# EAGLE design neato_lcd_adapter (EAGLE 8.3.2)
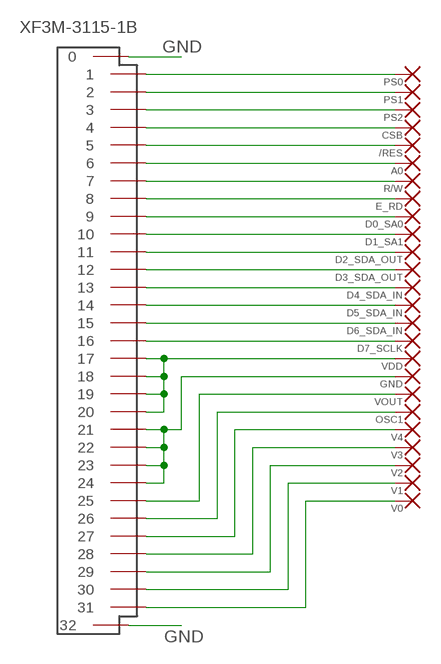
[diagram p0: schematic, sheet 1]

## Parts
/RES  SMD2  [SMD_PAD]
A0  SMD2  [SMD_PAD]
CSB  SMD2  [SMD_PAD]
D0_SA0  SMD2  [SMD_PAD]
D1_SA1  SMD2  [SMD_PAD]
D2_SDA_OUT  SMD2  [SMD_PAD]
D3_SDA_OUT  SMD2  [SMD_PAD]
D4_SDA_IN  SMD2  [SMD_PAD]
D5_SDA_IN  SMD2  [SMD_PAD]
D6_SDA_IN  SMD2  [SMD_PAD]
D7_SCLK  SMD2  [SMD_PAD]
E_RD  SMD2  [SMD_PAD]
GND  SMD2  [SMD_PAD]
LCD  XF3M-3115-1B  [FPC-31P-0.5MM]
OSC1  SMD2  [SMD_PAD]
PS0  SMD2  [SMD_PAD]
PS1  SMD2  [SMD_PAD]
PS2  SMD2  [SMD_PAD]
R/W  SMD2  [SMD_PAD]
V0  SMD2  [SMD_PAD]
V1  SMD2  [SMD_PAD]
V2  SMD2  [SMD_PAD]
V3  SMD2  [SMD_PAD]
V4  SMD2  [SMD_PAD]
VDD  SMD2  [SMD_PAD]
VOUT  SMD2  [SMD_PAD]

## Nets
GND: LCD.P$1 LCD.P$2
N$1: LCD.P$3 PS0.1(P)
N$2: LCD.P$4 PS1.1(P)
N$3: LCD.P$5 PS2.1(P)
N$4: CSB.1(P) LCD.P$6
N$5: /RES.1(P) LCD.P$7
N$6: A0.1(P) LCD.P$8
N$7: LCD.P$9 R/W.1(P)
N$8: E_RD.1(P) LCD.P$10
N$9: D0_SA0.1(P) LCD.P$11
N$10: D1_SA1.1(P) LCD.P$12
N$11: D2_SDA_OUT.1(P) LCD.P$13
N$12: D3_SDA_OUT.1(P) LCD.P$14
N$13: D4_SDA_IN.1(P) LCD.P$15
N$14: D5_SDA_IN.1(P) LCD.P$16
N$15: D6_SDA_IN.1(P) LCD.P$17
N$16: D7_SCLK.1(P) LCD.P$18
N$17: LCD.P$19 LCD.P$20 LCD.P$21 LCD.P$22 VDD.1(P)
N$18: GND.1(P) LCD.P$23 LCD.P$24 LCD.P$25 LCD.P$26
N$19: LCD.P$27 VOUT.1(P)
N$20: LCD.P$28 OSC1.1(P)
N$21: LCD.P$29 V4.1(P)
N$22: LCD.P$30 V3.1(P)
N$23: LCD.P$31 V2.1(P)
N$24: LCD.P$32 V1.1(P)
N$25: LCD.P$33 V0.1(P)

## Library data of the parts
/RES A0 CSB D0_SA0 D1_SA1 D2_SDA_OUT D3_SDA_OUT D4_SDA_IN D5_SDA_IN D6_SDA_IN D7_SCLK E_RD GND OSC1 PS0 PS1 PS2 R/W V0 V1-V4 VDD VOUT = neato_lcd_adapter:SMD2: SMD PAD
LCD = neato_lcd_adapter:XF3M-3115-1B

## Board
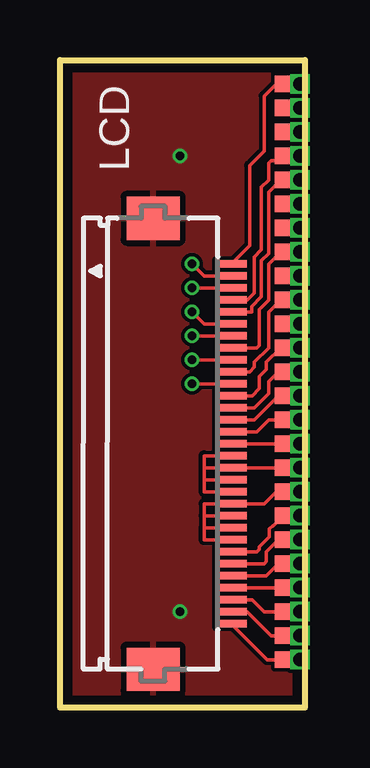
[diagram p1: board, top side]
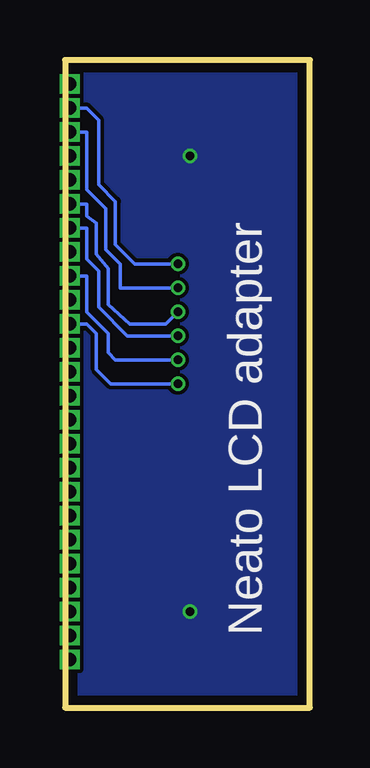
[diagram p2: board, bottom side, seen from below]

Size 10.2 x 27 mm. Coordinates in mm from the lower left corner, seen from the top.
Outline: 10.2,27 10.2,0 0,0 0,27 10.2,27
Copper layers (1*16): Top 0.035559375mm / dielectric 1.6mm / Bottom 0.035559375mm
Design rules "oshpark-2layer": minimum track width 6mil, minimum drill 10mil, track to track 6mil, track to pad 6mil, pad to pad 6mil, via to via 6mil, smd to smd 6mil, copper to edge 15mil, drill to drill 6mil, minimum pad ring 5mil, minimum via ring 5mil, stop-mask expansion 2.5mil, vias tented up to drill 0mil, thermal gap 10mil

### Footprints (pad centres in the part's own frame; a part is rotated, then mirrored left to right if it is on the bottom)
SMD_PAD = smd 0.7 x 0.7: 1 0,0
FPC-31P-0.5MM = smd 1.8 x 2.2: P$1 9.41,-1.1; P$2 -9.39,-1.1 | smd 0.3 x 1.3: P$3 -7.49,2.15; P$4 -6.99,2.15; P$5 -6.49,2.15; P$6 -5.99,2.15; P$7 -5.49,2.15; P$8 -4.99,2.15; P$9 -4.49,2.15; P$10 -3.99,2.15; P$11 -3.49,2.15; P$12 -2.99,2.15; P$13 -2.49,2.15; P$14 -1.99,2.15; P$15 -1.49,2.15; P$16 -0.99,2.15; P$17 -0.49,2.15; P$18 0.01,2.15; P$19 0.51,2.15; P$20 1.01,2.15; P$21 1.51,2.15; P$22 2.01,2.15; P$23 2.51,2.15; P$24 3.01,2.15; P$25 3.51,2.15; P$26 4.01,2.15; P$27 4.51,2.15; P$28 5.01,2.15; P$29 5.51,2.15; P$30 6.01,2.15; P$31 6.51,2.15; P$32 7.01,2.15; P$33 7.51,2.15

### Placement (x,y rotation side)
/RES  9.3,22 0 top
A0  9.3,21 0 top
CSB  9.3,23 0 top
D0_SA0  9.3,18 0 top
D1_SA1  9.3,17 0 top
D2_SDA_OUT  9.3,16 0 top
D3_SDA_OUT  9.3,15 0 top
D4_SDA_IN  9.3,14 0 top
D5_SDA_IN  9.3,13 0 top
D6_SDA_IN  9.3,12 0 top
D7_SCLK  9.3,11 0 top
E_RD  9.3,19 0 top
GND  9.3,9 0 top
LCD  4.98,11.01 270 top
OSC1  9.3,7 0 top
PS0  9.3,26 0 top
PS1  9.3,25 0 top
PS2  9.3,24 0 top
R/W  9.3,20 0 top
V0  9.3,2 0 top
V1  9.3,3 0 top
V2  9.3,4 0 top
V3  9.3,5 0 top
V4  9.3,6 0 top
VDD  9.3,10 0 top
VOUT  9.3,8 0 top

### Tracks (layer width: path | path; a pad name or v marks a point on that pad's centre or on a via)
GND  (via drill 0.35)
  other vias: 5,23 5,4
  pour Bottom: 10,27 0,27 0,0 10,0
  pour Top: 0,27 0,0 10,0 10,27
N$1  (via drill 0.55)
  Top 0.152: v10,26 PS0.1 9,26 8.5,25.5 8.5,23.2 7.9,22.6 7.9,19.27 LCD.P$3
N$2  (via drill 0.35, 0.55)
  Top 0.152: v10,25 PS1.1 | LCD.P$4 6,18 v5.5,18.5
  Bottom 0.152: v5.5,18.5 7.3,18.5 8.1,19.3 8.1,21.1 8.8,21.8 8.8,24.5 PS1.1 v10,25
N$3  (via drill 0.35, 0.55)
  Top 0.152: v10,24 PS2.1 | LCD.P$5 v5.5,17.5
  Bottom 0.152: v5.5,17.5 7.9,17.5 7.9,18.5 8.5,19.1 8.5,20.8 9.3,21.6 PS2.1 v10,24
N$4  (via drill 0.55)
  Top 0.152: LCD.P$6 7.8,17 8.09,17.29 8.09,18.79 8.4,19.09 8.4,21.69 8.7,22 8.7,22.7 8.8,22.8 9.1,22.8 CSB.1 v10,23
N$5  (via drill 0.55)
  Top 0.152: v10,22 /RES.1 9.2,22 8.7,21.5 8.7,18.93 8.4,18.63 8.4,17.13 7.99,16.73 7.99,16.5 LCD.P$7
N$6  (via drill 0.35, 0.55)
  Top 0.152: v10,21 A0.1 | LCD.P$8 6,16 v5.5,16.5
  Bottom 0.152: v5.5,16.5 6,16 7.5,16 8.4,16.8 8.4,18.3 8.9,18.9 8.9,20.2 9.3,20.5 A0.1 v10,21
N$7  (via drill 0.35, 0.55)
  Top 0.152: LCD.P$9 v5.5,15.5 | v10,20 R/W.1
  Bottom 0.152: v5.5,15.5 7.6,15.5 8.8,16.7 8.8,18.2 9.3,18.7 R/W.1 v10,20
N$8  (via drill 0.55)
  Top 0.152: v10,19 E_RD.1 9.2,19 8.7,18.5 8.7,17 8.3,16.6 8.3,15.1 8.2,15 LCD.P$10
N$9  (via drill 0.35, 0.55)
  Top 0.152: LCD.P$11 v5.5,14.5 | v10,18 D0_SA0.1
  Bottom 0.152: v5.5,14.5 8.1,14.5 8.4,14.8 8.4,15.6 9.3,16.5 D0_SA0.1 v10,18
N$10  (via drill 0.55)
  Top 0.152: LCD.P$12 7.9,14 8.1,14.2 8.1,14.4 8.7,15 8.7,16.5 9.2,17 D1_SA1.1 v10,17
N$11  (via drill 0.35, 0.55)
  Top 0.152: D2_SDA_OUT.1 v10,16 | LCD.P$13 v5.5,13.5
  Bottom 0.152: v5.5,13.5 8.3,13.5 8.9,14.1 8.9,15.6 D2_SDA_OUT.1 v10,16
N$12  (via drill 0.55)
  Top 0.152: LCD.P$14 8,13 8.3,13.3 8.3,13.8 8.6,14.1 8.6,14.4 9.2,15 D3_SDA_OUT.1 v10,15
N$13  (via drill 0.55)
  Top 0.152: v10,14 D4_SDA_IN.1 9.1,14 8.7,13.6 8.7,13.1 8.1,12.5 LCD.P$15
N$14  (via drill 0.55)
  Top 0.152: LCD.P$16 8.1,12 9.1,13 D5_SDA_IN.1 v10,13
N$15  (via drill 0.55)
  Top 0.152: LCD.P$17 8.2,11.5 8.7,12 D6_SDA_IN.1 v10,12
N$16  (via drill 0.55)
  Top 0.152: LCD.P$18 D7_SCLK.1 v10,11
N$17  (via drill 0.55)
  Top 0.152: LCD.P$22 6,9 6,9.5 | 6,9.5 LCD.P$21 | 6,9.5 6,10 | 6,10 LCD.P$20 VDD.1 v10,10 | 6,10 6,10.5 LCD.P$19
N$18  (via drill 0.55)
  Top 0.152: LCD.P$26 6,7 6,7.5 | LCD.P$25 6,7.5 | 6,8 6,7.5 | LCD.P$24 6,8 | 6,8 6,8.5 LCD.P$23 8.5,8.5 9,9 GND.1 v10,9
N$19  (via drill 0.55)
  Top 0.152: v10,8 VOUT.1 8.88,7.58 8.85,7.58 8.72,7.45 8.72,7.12 8.3,6.7 8.3,6.63 8.3,6.59 8.2,6.5 LCD.P$27
N$20  (via drill 0.55)
  Top 0.152: LCD.P$28 8.5,6 8.6,6.1 8.6,6.5 9.1,7 OSC1.1 v10,7
N$21  (via drill 0.55)
  Top 0.152: LCD.P$29 8.6,5.5 9.1,6 V4.1 v10,6
N$22  (via drill 0.55)
  Top 0.152: LCD.P$30 V3.1 v10,5
N$23  (via drill 0.55)
  Top 0.152: v10,4 V2.1 8.5,4 8,4.5 LCD.P$31
N$24  (via drill 0.55)
  Top 0.152: v10,3 V1.1 8.8,3 7.8,4 LCD.P$32
N$25  (via drill 0.55)
  Top 0.152: v10,2 V0.1 8.63,2 LCD.P$33

### Text on the board
bNames: Neato LCD adapter